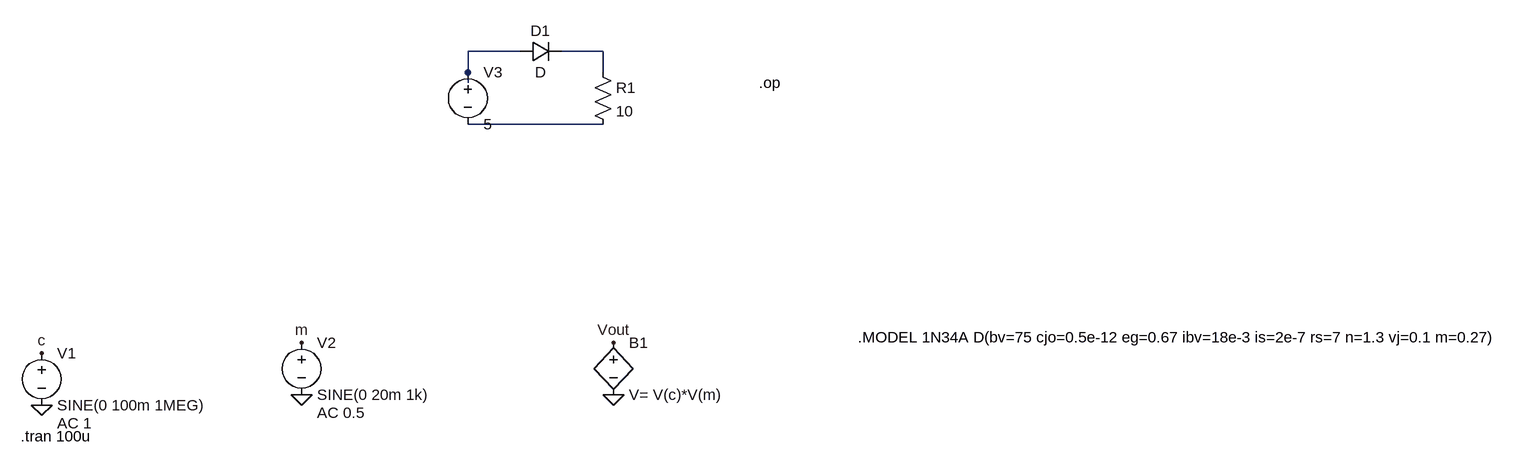
[diagram p0: schematic 10a.asc]
10a.asc, the LTspice schematic file:
Version 4
SHEET 1 1920 680
WIRE 304 -336 224 -336
WIRE 432 -336 368 -336
WIRE 224 -304 224 -336
WIRE 432 -304 432 -336
WIRE 224 -288 224 -304
WIRE 432 -224 224 -224
FLAG -432 208 0
FLAG -32 192 0
FLAG 448 192 0
FLAG 448 112 Vout
FLAG -432 128 c
FLAG -32 112 m
SYMBOL bv 448 96 R0
SYMATTR InstName B1
SYMATTR Value V= V(c)*V(m)
SYMBOL voltage -432 112 R0
WINDOW 123 24 124 Left 2
WINDOW 39 0 0 Left 0
SYMATTR InstName V1
SYMATTR Value SINE(0 100m 1MEG)
SYMATTR Value2 AC 1
SYMBOL voltage -32 96 R0
WINDOW 123 24 124 Left 2
WINDOW 39 0 0 Left 0
SYMATTR InstName V2
SYMATTR Value SINE(0 20m 1k)
SYMATTR Value2 AC 0.5
SYMBOL diode 304 -320 R270
WINDOW 0 32 32 VTop 2
WINDOW 3 0 32 VBottom 2
SYMATTR InstName D1
SYMBOL voltage 224 -320 R0
WINDOW 123 0 0 Left 0
WINDOW 39 0 0 Left 0
SYMATTR InstName V3
SYMATTR Value 5
SYMBOL res 416 -320 R0
SYMATTR InstName R1
SYMATTR Value 10
TEXT -464 256 Left 2 !.tran 100u
TEXT 824 104 Left 2 !.MODEL 1N34A D(bv=75 cjo=0.5e-12 eg=0.67 ibv=18e-3 is=2e-7 rs=7 n=1.3 vj=0.1 m=0.27)
TEXT 672 -288 Left 2 !.op

The netlist it stands for:
* 10a.asc
B1 Vout 0 V= V(c)*V(m)
V1 c 0 SINE(0 100m 1MEG) AC 1
V2 m 0 SINE(0 20m 1k) AC 0.5
D1 N001 N002 D
V3 N001 N003 5
R1 N002 N003 10
.model D D
.lib standard.dio
.tran 100u
.MODEL 1N34A D(bv=75 cjo=0.5e-12 eg=0.67 ibv=18e-3 is=2e-7 rs=7 n=1.3 vj=0.1 m=0.27)
.op
.backanno
.end